# EAGLE design combo-02 (EAGLE 7.7.0)
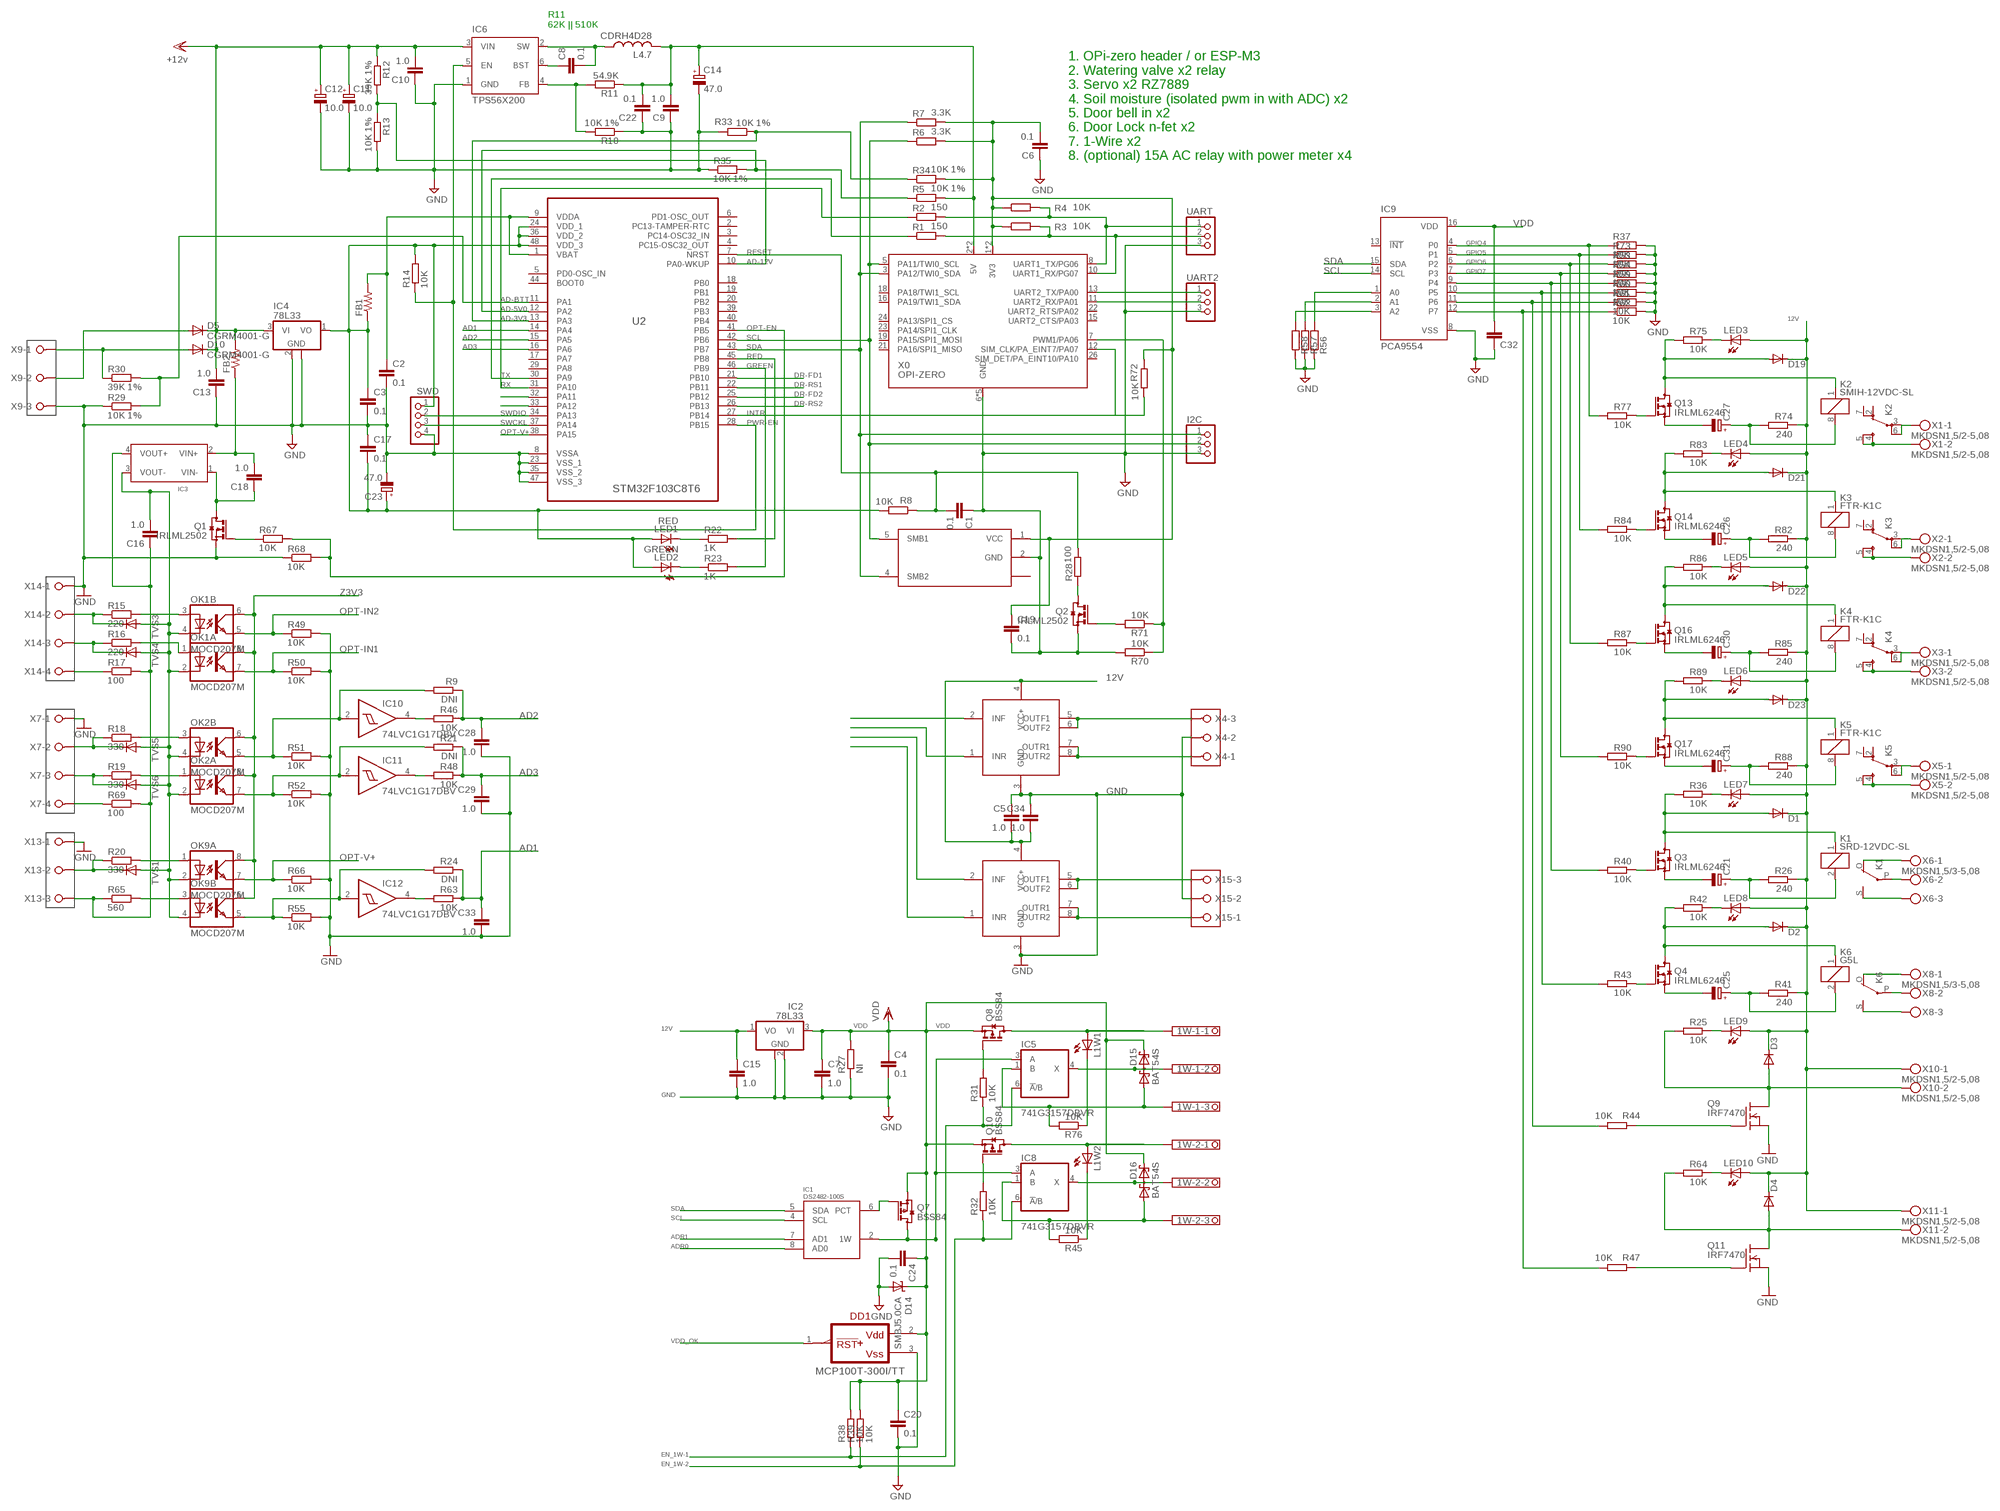
[diagram p0: schematic, sheet 1]

## Parts
1W-1  1751251  [1751251]
1W-2  1751251  [1751251]
C1  0.1  C-EUC0603  [C0603]
C2  0.1  C-EUC0603  [C0603]
C3  0.1  C-EUC0603  [C0603]
C4  0.1  C-EUC0603  [C0603]
C5  1.0  C-EUC0805  [C0805]
C6  0.1  C-EUC0805  [C0805]
C7  1.0  C-EUC0805  [C0805]
C8  0.1  C-EUC0805  [C0805]
C9  1.0  C-EUC0805  [C0805]
C10  1.0  C-EUC1206  [C1206]
C11  10.0  CPOL-EUC/6032-28R  [C/6032-28R]
C12  10.0  CPOL-EUC/6032-28R  [C/6032-28R]
C13  1.0  C-EUC1206  [C1206]
C14  47.0  CPOL-EUB/3528-21R  [B/3528-21R]
C15  1.0  C-EUC0805  [C0805]
C16  1.0  C-EUC1206  [C1206]
C17  0.1  C-EUC0603  [C0603]
C18  1.0  C-EUC1206  [C1206]
C19  0.1  C-EUC0603  [C0603]
C20  0.1  C-EUC0603  [C0603]
C21  CPOL-EUE3.5-8  [E3,5-8]
C22  0.1  C-EUC0805  [C0805]
C23  47.0  CPOL-EUB/3528-21R  [B/3528-21R]
C24  0.1  C-EUC0603  [C0603]
C25  CPOL-EUE3.5-8  [E3,5-8]
C26  CPOL-EUE3.5-8  [E3,5-8]
C27  CPOL-EUE3.5-8  [E3,5-8]
C28  1.0  C-EUC0805  [C0805]
C29  1.0  C-EUC0805  [C0805]
C30  CPOL-EUE3.5-8  [E3,5-8]
C31  CPOL-EUE3.5-8  [E3,5-8]
C32  C-EUC0805  [C0805]
C33  1.0  C-EUC0805  [C0805]
C34  1.0  C-EUC0805  [C0805]
D1  DIODE-SOD123  [SOD123]
D2  DIODE-SOD123  [SOD123]
D3  DIODE-SOD123  [SOD123]
D4  DIODE-SOD123  [SOD123]
D5  CGRM4001-G  [SOD-123_MINI-SMA]
D10  CGRM4001-G  [SOD-123_MINI-SMA]
D14  SMBJ5.0CA  SUPPRESSOR-SMBJ  [SMBJ]
D15  BAT54S  [SOT23]
D16  BAT54S  [SOT23]
D19  DIODE-SOD123  [SOD123]
D21  DIODE-SOD123  [SOD123]
D22  DIODE-SOD123  [SOD123]
D23  DIODE-SOD123  [SOD123]
DD1  MCP100T-300I/TT  [SOT23]
FB1  R-US_R0805  [R0805]
FB2  R-US_R1206  [R1206]
I2C  PINHD-1X3  [1X03]
IC1  DS2482-100S  [SO08]
IC2  78L33  78L05F  [SOT89]
IC3  DC-DC-CONV-4PIN-ISOLATINGMURATA-NME-05-12-SERIES  [DC-DC-MURATA-NME-05-12-SERIES]
IC4  78L33  78L05F  [SOT89]
IC5  741G3157DBVR  [DBV_R-PDSO-G6]
IC6  TPS56X200  [TSOT23-6_DDC]
IC7  LTC1694  [SOT23-5]
IC8  741G3157DBVR  [DBV_R-PDSO-G6]
IC9  PCA9554  PCF8574T  [SO16W]
IC10  74LVC1G17DBV  [SOT23-5]
IC11  74LVC1G17DBV  [SOT23-5]
IC12  74LVC1G17DBV  [SOT23-5]
K1  SRD-12VDC-SL  G5L  [G5LE]
K2  SMIH-12VDC-SL  FTR-K1C  [FTR-K1C]
K3  FTR-K1C  [FTR-K1C]
K4  FTR-K1C  [FTR-K1C]
K5  FTR-K1C  [FTR-K1C]
K6  G5L  [G5LE]
L1W1  LEDSMT1206  [1206]
L1W2  LEDSMT1206  [1206]
L4.7  CDRH4D28  [CDRH4D28]
LED1  RED  LEDCHIPLED_1206  [CHIPLED_1206]
LED2  GREEN  LEDCHIPLED_1206  [CHIPLED_1206]
LED3  LEDSMT1206  [1206]
LED4  LEDSMT1206  [1206]
LED5  LEDSMT1206  [1206]
LED6  LEDSMT1206  [1206]
LED7  LEDSMT1206  [1206]
LED8  LEDSMT1206  [1206]
LED9  LEDSMT1206  [1206]
LED10  LEDSMT1206  [1206]
OK1  MOCD207M  [SOIC08-FAIRCHILD]
OK2  MOCD207M  [SOIC08-FAIRCHILD]
OK9  MOCD207M  [SOIC08-FAIRCHILD]
Q1  IRLML2502  [SOT23]
Q2  IRLML2502  [SOT23]
Q3  IRLML6246  BSS123  [SOT23]
Q4  IRLML6246  BSS123  [SOT23]
Q7  BSS84  [SOT23]
Q8  BSS84  [SOT23]
Q9  IRF7470  FDS5680  [SO-8]
Q10  BSS84  [SOT23]
Q11  IRF7470  FDS5680  [SO-8]
Q13  IRLML6246  BSS123  [SOT23]
Q14  IRLML6246  BSS123  [SOT23]
Q16  IRLML6246  BSS123  [SOT23]
Q17  IRLML6246  BSS123  [SOT23]
R1  150  R-EU_R0603  [R0603]
R2  150  R-EU_R0603  [R0603]
R3  10K  R-EU_R0603  [R0603]
R4  10K  R-EU_R0603  [R0603]
R5  10K 1%  R-EU_R0603  [R0603]
R6  3.3K  R-EU_R0603  [R0603]
R7  3.3K  R-EU_R0603  [R0603]
R8  10K  R-EU_R0603  [R0603]
R9  DNI  R-EU_R0603  [R0603]
R10  10K 1%  R-EU_R0603  [R0603]
R11  54.9K  R-EU_R0603  [R0603]
R12  39K 1%  R-EU_R0603  [R0603]
R13  10K 1%  R-EU_R0603  [R0603]
R14  10K  R-EU_R0603  [R0603]
R15  220  R-EU_R0603  [R0603]
R16  220  R-EU_R0603  [R0603]
R17  100  R-EU_R0603  [R0603]
R18  330  R-EU_R0603  [R0603]
R19  330  R-EU_R0603  [R0603]
R20  330  R-EU_R0603  [R0603]
R21  DNI  R-EU_R0603  [R0603]
R22  1K  R-EU_R0603  [R0603]
R23  1K  R-EU_R0603  [R0603]
R24  DNI  R-EU_R0603  [R0603]
R25  10K  R-EU_R0603  [R0603]
R26  240  R-EU_R1206  [R1206]
R27  NI  R-EU_R0603  [R0603]
R28  100  R-EU_R0603  [R0603]
R29  10K 1%  R-EU_R0603  [R0603]
R30  39K 1%  R-EU_R0603  [R0603]
R31  10K  R-EU_R0603  [R0603]
R32  10K  R-EU_R0603  [R0603]
R33  10K 1%  R-EU_R0603  [R0603]
R34  10K 1%  R-EU_R0603  [R0603]
R35  10K 1%  R-EU_R0603  [R0603]
R36  10K  R-EU_R0603  [R0603]
R37  10K  R-EU_R0603  [R0603]
R38  10K  R-EU_R0603  [R0603]
R39  10K  R-EU_R0603  [R0603]
R40  10K  R-EU_R0603  [R0603]
R41  240  R-EU_R1206  [R1206]
R42  10K  R-EU_R0603  [R0603]
R43  10K  R-EU_R0603  [R0603]
R44  10K  R-EU_R0603  [R0603]
R45  10K  R-EU_R0603  [R0603]
R46  10K  R-EU_R0603  [R0603]
R47  10K  R-EU_R0603  [R0603]
R48  10K  R-EU_R0603  [R0603]
R49  10K  R-EU_R0603  [R0603]
R50  10K  R-EU_R0603  [R0603]
R51  10K  R-EU_R0603  [R0603]
R52  10K  R-EU_R0603  [R0603]
R53  10K  R-EU_R0603  [R0603]
R54  10K  R-EU_R0603  [R0603]
R55  10K  R-EU_R0603  [R0603]
R56  R-EU_R0603  [R0603]
R57  R-EU_R0603  [R0603]
R58  R-EU_R0603  [R0603]
R59  10K  R-EU_R0603  [R0603]
R60  10K  R-EU_R0603  [R0603]
R61  10K  R-EU_R0603  [R0603]
R62  10K  R-EU_R0603  [R0603]
R63  10K  R-EU_R0603  [R0603]
R64  10K  R-EU_R0603  [R0603]
R65  560  R-EU_R0603  [R0603]
R66  10K  R-EU_R0603  [R0603]
R67  10K  R-EU_R0603  [R0603]
R68  10K  R-EU_R0603  [R0603]
R69  100  R-EU_R0603  [R0603]
R70  10K  R-EU_R0603  [R0603]
R71  10K  R-EU_R0603  [R0603]
R72  10K  R-EU_R0603  [R0603]
R73  10K  R-EU_R0603  [R0603]
R74  240  R-EU_R1206  [R1206]
R75  10K  R-EU_R0603  [R0603]
R76  10K  R-EU_R0603  [R0603]
R77  10K  R-EU_R0603  [R0603]
R82  240  R-EU_R1206  [R1206]
R83  10K  R-EU_R0603  [R0603]
R84  10K  R-EU_R0603  [R0603]
R85  240  R-EU_R1206  [R1206]
R86  10K  R-EU_R0603  [R0603]
R87  10K  R-EU_R0603  [R0603]
R88  240  R-EU_R1206  [R1206]
R89  10K  R-EU_R0603  [R0603]
R90  10K  R-EU_R0603  [R0603]
SWD  PINHD-1X4  [1X04]
TVS1  DIODE-SOD323-W  [SOD323-W]
TVS3  DIODE-SOD323-W  [SOD323-W]
TVS4  DIODE-SOD323-W  [SOD323-W]
TVS5  DIODE-SOD323-W  [SOD323-W]
TVS6  DIODE-SOD323-W  [SOD323-W]
U2  STM32F103C8T6  STM32F100CBT6B  [QFP50P900X900X160-48N]
U$10  RZ7889  [SO8]
U$11  RZ7889  [SO8]
UART  PINHD-1X3  [1X03]
UART2  PINHD-1X3  [1X03]
X0  OPI-ZERO  [OPI0]
X1  MKDSN1,5/2-5,08  [MKDSN1,5/2-5,08]
X2  MKDSN1,5/2-5,08  [MKDSN1,5/2-5,08]
X3  MKDSN1,5/2-5,08  [MKDSN1,5/2-5,08]
X4  W237-03P  [W237-133]
X5  MKDSN1,5/2-5,08  [MKDSN1,5/2-5,08]
X6  MKDSN1,5/3-5,08  [MKDSN1,5/3-5,08]
X7  W237-04P  [W237-4P]
X8  MKDSN1,5/3-5,08  [MKDSN1,5/3-5,08]
X9  W237-03P  [W237-133]
X10  MKDSN1,5/2-5,08  [MKDSN1,5/2-5,08]
X11  MKDSN1,5/2-5,08  [MKDSN1,5/2-5,08]
X13  W237-03P  [W237-133]
X14  W237-04P  [W237-4P]
X15  W237-03P  [W237-133]

## Nets
1W: IC1.2(1W) IC5.3(A) IC8.3(A) Q7.3(D)
1W1-VDD: 1W-1.1 L1W1.A Q8.3(D)
1W2-VDD: 1W-2.1 L1W2.A Q10.3(D)
12V [POWER]: C5.2 C10.2 C11.+ C12.+ C13.2 C15.1 C34.2 D1.C D2.C D3.C D4.C D5.C D10.C D19.C D21.C D22.C D23.C FB2.2 IC2.1(VO) IC4.3(VI) IC6.3(VIN) LED3.A LED4.A LED5.A LED6.A LED7.A LED8.A LED9.A LED10.A R12.1 R26.1 R41.1 R74.1 R82.1 R85.1 R88.1 U$10.4(VCC+) U$11.4(VCC+) X10.1 X11.1 ; supply symbol labelled +12v
+3V3 [POWER]: C3.1 C17.2 C23.+ FB1.1 IC4.1(VO) LED1.A LED2.A R8.2 R14.2 SWD.1 U2.24(VDD_1) U2.36(VDD_2) U2.48(VDD_3)
AD1: C33.1 R24.1 R63.1 U2.14(PA4)
AD2: C28.1 R9.1 R46.1 U2.15(PA5)
AD3: C29.1 R21.1 R48.1 U2.16(PA6)
AD-3V3: R33.1 R34.1 U2.13(PA3)
AD-5V0: R5.1 R35.2 U2.12(PA2)
AD-12V: R12.2 R13.1 U2.10(PA0-WKUP)
AD-BTT: R29.2 R30.2 U2.11(PA1)
ADR0: IC1.8(AD0)
ADR1: IC1.7(AD1)
ADR2: IC9.3(A2) R58.2
ADR3: IC9.2(A1) R57.2
ADR4: IC9.1(A0) R56.2
BAT+ [POWER]: D10.A R30.1 X9.1
DR-FD1: U2.21(PB10)
DR-FD2: U2.25(PB12)
DR-RS1: U2.22(PB11)
DR-RS2: U2.26(PB13)
EN_1W-1: IC5.6(!A!/B) R31.1 R38.1
EN_1W-2: IC8.6(!A!/B) R32.1 R39.1
FET: D3.A Q9.5(D) Q9.6(D) Q9.7(D) Q9.8(D) R25.2 X10.2
FET1: D4.A Q11.5(D) Q11.6(D) Q11.7(D) Q11.8(D) R64.2 X11.2
GND [POWER]: 1W-1.3 1W-2.3 C1.1 C2.2 C3.2 C4.2 C5.1 C6.1 C7.2 C9.1 C10.1 C11.- C12.- C13.1 C14.- C15.2 C17.1 C19.2 C20.2 C21.- C22.1 C23.- C24.2 C25.- C26.- C27.- C28.2 C29.2 C30.- C31.- C32.1 C33.2 C34.1 D14.A D15.1(A1) D16.1(A1) DD1.3(VSS) I2C.3 IC2.2(GND) IC2.2@1(GND) IC4.2(GND) IC4.2@1(GND) IC5.1(B) IC6.1(GND) IC7.2(GND) IC8.1(B) IC9.8(VSS) Q1.2(S) Q2.2(S) Q3.2(S) Q4.2(S) Q9.1(S) Q9.2(S) Q9.3(S) Q11.1(S) Q11.2(S) Q11.3(S) Q13.2(S) Q14.2(S) Q16.2(S) Q17.2(S) R10.1 R13.2 R27.1 R29.1 R33.2 R35.1 R37.2 R45.2 R49.2 R50.2 R51.2 R52.2 R53.2 R54.2 R55.2 R56.1 R57.1 R58.1 R59.2 R60.2 R61.2 R62.2 R66.2 R68.1 R70.2 R73.2 R76.2 SWD.4 U2.8(VSSA) U2.23(VSS_1) U2.35(VSS_2) U2.47(VSS_3) U$10.3(GND) U$11.3(GND) UART2.3 UART.3 X0.6(GND) X0.9(GND) X0.14(GND) X0.20(GND) X0.25(GND) X4.2 X7.1 X9.3 X13.1 X14.1 X15.2
GPIO1: IC9.9(P4) R40.2 R59.1
GPIO2: IC9.10(P5) R43.2 R60.1
GPIO4: IC9.4(P0) R37.1 R77.2
GPIO5: IC9.5(P1) R73.1 R84.2
GPIO6: IC9.6(P2) R53.1 R87.2
GPIO7: IC9.7(P3) R54.1 R90.2
GREEN: R23.2 U2.46(PB9)
IN12V [POWER]: D5.A X9.2
INTR: R72.2 U2.27(PB14) X0.12(SIM_CLK/PA_EINT7/PA07)
IO13: IC9.11(P6) R44.2 R61.1
N$1: C16.1 IC3.4(VOUT+) R17.2 R65.1 R69.2 X13.3
N$2: K3.4(-1:SA) K3.5(-1:SB) X2.2
N$3 [POWER]: C8.2 IC6.2(SW) L4.7.P$1
N$4: Q2.3(D) R28.1
N$5: Q2.1(G) R71.2
N$7: OK9.1(A:A) R20.2
N$8: OK9.3(B:A) R65.2
N$9: IC10.2(I) OK2.5(B:EMIT) R9.2 R51.1
N$10: Q9.4(G) R44.1
N$11: IC1.6(PCT) Q7.1(G)
N$13: Q14.1(G) R84.1
N$14: OK1.3(B:A) R15.2
N$15: D1.A K1.1 Q3.3(D) R36.2
N$16: C21.+ K1.2 R26.2
N$17: C8.1 IC6.6(BST)
N$18: LED7.C R36.1
N$19: Q3.1(G) R40.1
N$20: D2.A K6.1 Q4.3(D) R42.2
N$21: C25.+ K6.2 R41.2
N$22: IC6.4(FB) R10.2 R11.2
N$23: LED8.C R42.1
N$24: Q4.1(G) R43.1
N$25: R20.1 TVS1.C X13.2
N$26: R15.1 TVS3.C X14.2
N$27: 1W-1.2 D15.3(C1A2) IC5.4(X)
N$28: R16.1 TVS4.C X14.3
N$29: C16.2 IC3.3(VOUT-) OK1.2(A:C) OK1.4(B:C) OK2.2(A:C) OK2.4(B:C) OK9.2(A:C) OK9.4(B:C) TVS1.A TVS3.A TVS4.A TVS5.A TVS6.A
N$30: R17.1 X14.4
N$31: U$10.2(INF)
N$32: R18.1 TVS5.C X7.2
N$33: R19.1 TVS6.C X7.3
N$34: U$10.1(INR)
N$35: OK2.3(B:A) R18.2
N$36: IC12.2(I) OK9.5(B:EMIT) R24.2 R55.1
N$37: Q8.1(G) R31.2
N$38: U$11.2(INF)
N$39: IC9.12(P7) R47.2 R62.1
N$40: K3.3(-1:PA) K3.6(-1:PB) X2.1
N$41: 1W-2.2 D16.3(C1A2) IC8.4(X)
N$42: K4.3(-1:PA) K4.6(-1:PB) X3.1
N$43: K4.4(-1:SA) K4.5(-1:SB) X3.2
N$44: K5.3(-1:PA) K5.6(-1:PB) X5.1
N$45: Q10.1(G) R32.2
N$46: K5.4(-1:SA) K5.5(-1:SB) X5.2
N$47: K1.P(2:P) X6.2
N$48: K1.O(2:O) X6.1
N$49: K1.S(2:S) X6.3
N$50: K6.O(2:O) X8.1
N$51: K6.P(2:P) X8.2
N$52: K6.S(2:S) X8.3
N$53: IC10.4(O) R46.2
N$54: IC11.4(O) R48.2
N$55: D19.A K2.1 Q13.3(D) R75.2
N$56: IC12.4(O) R63.2
N$57: U$11.1(INR)
N$58: U$10.5(OUTF1) U$10.6(OUTF2) X4.3
N$59: U$10.7(OUTR1) U$10.8(OUTR2) X4.1
N$60: C27.+ K2.8 R74.2
N$61: U$11.5(OUTF1) U$11.6(OUTF2) X15.3
N$62: LED3.C R75.1
N$63: U$11.7(OUTR1) U$11.8(OUTR2) X15.1
N$65: OK1.1(A:A) R16.2
N$66: OK2.1(A:A) R19.2
N$69: Q11.4(G) R47.1
N$70: LED10.C R64.1
N$71: LED9.C R25.1
N$74: R69.1 X7.4
N$75: LED1.C R22.1
N$95: Q1.1(G) R67.1
N$98: C18.1 IC3.1(VIN-) Q1.3(D)
N$99 [POWER]: C18.2 FB2.1 IC3.2(VIN+)
N$111: D21.A K3.1 Q14.3(D) R83.2
N$112: Q13.1(G) R77.1
N$115: L1W2.C R45.1
N$116: L1W1.C R76.1
N$117: C26.+ K3.8 R82.2
N$118: LED4.C R83.1
N$119: LED2.C R23.1
N$120: D22.A K4.1 Q16.3(D) R86.2
N$121: C30.+ K4.8 R85.2
N$122: LED5.C R86.1
N$123: Q16.1(G) R87.1
N$124: D23.A K5.1 Q17.3(D) R89.2
N$125: C31.+ K5.8 R88.2
N$126: LED6.C R89.1
N$127: Q17.1(G) R90.1
N$128: K2.3(-1:PA) K2.6(-1:PB) X1.1
N$129: K2.4(-1:SA) K2.5(-1:SB) X1.2
OPT-EN: R67.2 R68.2 U2.41(PB5)
OPT-IN1: OK1.7(A:EMIT) R50.1 U2.32(PA11)
OPT-IN2: OK1.5(B:EMIT) R49.1 U2.33(PA12)
OPT-V+: OK9.7(A:EMIT) R66.1 U2.38(PA15)
PA06: R70.1 R71.1 X0.7(PWM1/PA06)
PWR-EN: IC6.5(EN) R14.1 U2.28(PB15)
RED: R22.2 U2.45(PB8)
RESET: C1.2 R8.1 R28.2 U2.7(NRST)
RX: R2.1 U2.31(PA10)
SCL: I2C.2 IC1.4(SCL) IC7.5(SMB1) IC9.14(SCL) R6.1 U2.42(PB6) X0.5(PA11/TWI0_SCL)
SDA: I2C.1 IC1.5(SDA) IC7.4(SMB2) IC9.15(SDA) R7.1 U2.43(PB7) X0.3(PA12/TWI0_SDA)
SWCKL: SWD.3 U2.37(PA14)
SWDIO: SWD.2 U2.34(PA13)
TX: R1.1 U2.30(PA9)
VDD: C4.1 C7.1 C20.1 C24.1 C32.2 D14.C D15.2(C2) D16.2(C2) DD1.2(VDD) IC2.3(VI) IC9.16(VDD) Q7.2(S) Q8.2(S) Q10.2(S) R27.2 R38.2 R39.2
VDD_OK: DD1.1(!RST)
VDDA: C2.1 FB1.2 U2.1(VBAT) U2.9(VDDA)
X7.2: IC11.2(I) OK2.7(A:EMIT) R21.2 R52.1
Z2RX: UART2.2 X0.11(UART2_RX/PA01)
Z2TX: UART2.1 X0.13(UART2_TX/PA00)
Z3V3 [POWER]: C6.2 C19.1 IC7.1(VCC) OK1.6(B:COL) OK1.8(A:COL) OK2.6(B:COL) OK2.8(A:COL) OK9.6(B:COL) OK9.8(A:COL) R3.1 R4.1 R6.2 R7.2 R34.2 R72.1 X0.1(3V3) X0.17(3V3)
Z5V [POWER]: C9.2 C14.+ C22.2 L4.7.P$2 R5.2 R11.1 X0.2(5V) X0.4(5V)
ZRX: R1.2 R3.2 UART.2 X0.10(UART1_RX/PG07)
ZTX: R2.2 R4.2 UART.1 X0.8(UART1_TX/PG06)
Unconnected: IC7.3(NC) IC9.13(!INT) K2.2(-1:OA) K2.7(-1:OB) K3.2(-1:OA) K3.7(-1:OB) K4.2(-1:OA) K4.7(-1:OB) K5.2(-1:OA) K5.7(-1:OB) U2.2(PC13-TAMPER-RTC) U2.3(PC14-OSC32_IN) U2.4(PC15-OSC32_OUT) U2.5(PD0-OSC_IN) U2.6(PD1-OSC_OUT) U2.17(PA7) U2.18(PB0) U2.19(PB1) U2.20(PB2) U2.29(PA8) U2.39(PB3) U2.40(PB4) U2.44(BOOT0) X0.15(UART2_CTS/PA03) X0.16(PA19/TWI1_SDA) X0.18(PA18/TWI1_SCL) X0.19(PA15/SPI1_MOSI) X0.21(PA16/SPI1_MISO) X0.22(UART2_RTS/PA02) X0.23(PA14/SPI1_CLK) X0.24(PA13/SPI1_CS) X0.26(SIM_DET/PA_EINT10/PA10)

## Notes on the sheet
- R11
  62K || 510K
- 1. OPi-zero header / or ESP-M3 
  2. Watering valve x2 relay
  3. Servo x2 RZ7889
  4. Soil moisture (isolated pwm in with ADC) x2
  5. Door bell in x2
  6. Door Lock n-fet x2
  7. 1-Wire x2
  8. (optional) 15A AC relay with power meter x4

## Power pins joined to a net without a drawn wire
12V: IC1.1(VDD)
+3V3: IC5.5(VCC) IC8.5(VCC)
GND: IC1.3(GND) IC5.2(GND) IC8.2(GND) IC10.3(GND) IC11.3(GND) IC12.3(GND)
VCC: IC10.5(VCC) IC11.5(VCC) IC12.5(VCC)

## Library data of the parts
1W-1 1W-2 = con-phoenix-350:1751251: MKDS 1/ 3-3,5 Printklemme Nennstrom: 10 A Bemessungsspannung: 160 V Raster: 3,5 mm Polzahl: 3 Montageart: Löten Anschlussart: Schraubanschluss Anschlussrichtung vom Leiter zur Platine: 0° Source: http://eshop.phoenixcontact.com .. 1751251.pdf; OC_FARNELL: unknown; OC_NEWARK: unknown
C1-C10 C13 C15-C20 C22 C24 C28 C29 C32-C34 = rcl:C-EU: CAPACITOR, European symbol
C11 C12 C14 C21 C23 C25-C27 C30 C31 = rcl:CPOL-EU: POLARIZED CAPACITOR, European symbol
D1-D4 D19 D21-D23 TVS1 TVS3-TVS6 = diode:DIODE-: DIODE
D5 D10 = diode:CGRM400*-G: Molded plasitc,JEDEC SOD-123/Mini SMA Source: Comchip CGRM4001-G.pdf
D14 = diode:SUPPRESSOR-: Suppressor diode
D15 D16 = diode:BAT54S: Schottky Diodes Pin connection corrected 2011-05-04 Source: Fairchild .. BAT54.pdf
DD1 = ic-microchip:MCP100; MOUSER: 579-MCP100T-300I/TT
FB1 FB2 = rcl:R-US_: RESISTOR, American symbol
I2C UART UART2 = pinhead:PINHD-1X3: PIN HEADER
IC1 = 1wire:DS2482-100: I2C to 1-Wire Host Adapter/Line Driver This device is a onewire host and I2C interface in one chip. It provides the complete DC/AC requirements for onewire communication, including overdrive speed mode, but, unlike the DS2480B chip, no 12V EPROM programming. Notes: For overdrive speed and 5V EEPROM programming, an external active pullup circuit must be connected to the 1W, VDD and PCT pin. See the datasheet for details. The lower two I2C adress bits of the chip can be selected by external pins, so up to 4 chips may be connected to the same I2C bus. Author: Orginal device and description from Giovanni Varasano <giovanni.varasano@fastwebnet.it> Improved by Jan Kandziora <jjj@gmx.de>
IC2 IC4 = linear:78L*: POSITOIV-VOLTAGE REGULATORS Output up to 100 mA Source: Datasheet <http://focus.ti.com/lit/ds/symlink/ua78l05.pdf>
IC3 = SteveMarple:DC-DC-CONV-4PIN-ISOLATING
IC5 IC8 = 74xx-little-de:74*1G3157: Single-Pole, Double-Throw Analog Switch Source: http://focus.ti.com/lit/ds/symlink/sn74lvc1g3157.pdf
IC6 = custom:TPS56X200
IC7 = components:LTC1694: Dual SMBus active pull-up
IC9 = micro-philips:PCF8574: I2C-Bus Remote 8-bit I/O expander http://www.semiconductors.philips.com/acrobat_download/datasheets/PCF8574_4.pdf; MPN: PCF8574T/3,512; OC_FARNELL: 1201255; OC_NEWARK: 70R6870
IC10-IC12 = 74xx-little-us:74*1G17: Single Schmitt-Trigger Buffer
K1 K6 = relay:G5L: RELAY 1 x switch, 10 A/120 V AC, 8 A/30 V ADC, Omron; OC_FARNELL: unknown; OC_NEWARK: unknown
K2-K5 = relay:FTR-K1C: NETZRELAIS FTR-K1CK024W1XUM 16A/250VAC 1 Umschaltkontakt Distributor: Conrad Electronic Bestell Nr.: 504389-13 - 24V Source: http://www.produktinfo.conrad.com/datenblaetter/500000-524999/504384-da-01-de-NETZRELAIS_FTR_K1CK012W1XUM_16A_250VAC.pdf; OC_FARNELL: unknown; OC_NEWARK: unknown
L1W1 L1W2 LED1-LED10 = led:LED: LED OSRAM: - CHIPLED LG R971, LG N971, LY N971, LG Q971, LY Q971, LO R971, LY R971 LH N974, LH R974 LS Q976, LO Q976, LY Q976 LO Q996 - Hyper CHIPLED LW Q18S LB Q993, LB Q99A, LB R99A - SideLED LS A670, LO A670, LY A670, LG A670, LP A670 LB A673, LV A673, LT A673, LW A673 LH A674 LY A675 LS A676, LA A676, LO A676, LY A676, LW A676 LS A679, LY A679, LG A679 - Hyper Micro SIDELED® LS Y876, LA Y876, LO Y876, LY Y876 LT Y87S - SmartLED LW L88C, LW L88S LB L89C, LB L89S, LG L890 LS L89K, LO L89K, LY L89K LS L896, LA L896, LO L896, LY L896 - TOPLED LS T670, LO T670, LY T670, LG T670, LP T670 LSG T670, LSP T670, LSY T670, LOP T670, LYG T670 LG T671, LOG T671, LSG T671 LB T673, LV T673, LT T673, LW T673 LH T674 LS T676, LA T676, LO T676, LY T676, LB T676, LH T676, LSB T676, LW T676 LB T67C, LV T67C, LT T67C, LS T67K, LO T67K, LY T67K, LW E67C LS E67B, LA E67B, LO E67B, LY E67B, LB E67C, LV E67C, LT E67C LW T67C LS T679, LY T679, LG T679 LS T770, LO T770, LY T770, LG T770, LP T770 LB T773, LV T773, LT T773, LW T773 LH T774 LS E675, LA E675, LY E675, LS T675 LS T776, LA T776, LO T776, LY T776, LB T776 LHGB T686 LT T68C, LB T68C - Hyper Mini TOPLED® LB M676 - Mini TOPLED Santana® LG M470 LS M47K, LO M47K, LY M47K Source: http://www.osram.convergy.de LUXEON: - LUMILED® LXK2-PW12-R00, LXK2-PW12-S00, LXK2-PW14-U00, LXK2-PW14-V00 LXK2-PM12-R00, LXK2-PM12-S00, LXK2-PM14-U00 LXK2-PE12-Q00, LXK2-PE12-R00, LXK2-PE12-S00, LXK2-PE14-T00, LXK2-PE14-U00 LXK2-PB12-K00, LXK2-PB12-L00, LXK2-PB12-M00, LXK2-PB14-N00, LXK2-PB14-P00, LXK2-PB14-Q00 LXK2-PR12-L00, LXK2-PR12-M00, LXK2-PR14-Q00, LXK2-PR14-R00 LXK2-PD12-Q00, LXK2-PD12-R00, LXK2-PD12-S00 LXK2-PH12-R00, LXK2-PH12-S00 LXK2-PL12-P00, LXK2-PL12-Q00, LXK2-PL12-R00 Source: www.luxeon.com KINGBRIGHT: KA-3528ASYC Source: www.kingbright.com
L4.7 = custom:CDRH4D28
OK1 OK2 OK9 = optocoupler:MOCD20*M: MOCD207M, MOCD208M Dual Channel Phototransistor Small Outline Surface Mount Optocouplers Source: Data sheet <http://www.fairchildsemi.com/ds/MO%2FMOCD207-M.pdf>; MF: FAIRCHILD SEMICONDUCTOR; MPN: MOCD207-M; OC_FARNELL: 1623297; OC_NEWARK: 67K0803
Q1 Q2 = components:IRLML2502: N-CHANNEL MOS FET
Q3 Q4 Q13 Q14 Q16 Q17 = transistor-small-signal:BSS123: N-CHANNEL MOS FET
Q7 Q8 Q10 = transistor-small-signal:BSS84: P-CHANNEL MOS FET
Q9 Q11 = transistor-fet:FDS5680: 60V N-Channel PowerTrench TM MOSFET FAIRCHILD FDS5680.pdf
R1-R77 R82-R90 = rcl:R-EU_: RESISTOR, European symbol
SWD = pinhead:PINHD-1X4: PIN HEADER
U2 = ST Microelctronics_By_element14_Batch_1:STM32F100CBT6B: ARM-based 32-bit MCU; MPN: STM32F100CBT6B; OC_FARNELL: 1838512; OC_NEWARK: 86R1308; PACKAGE: LQFP-48; SUPPLIER: STMircroelectronics
U$10 U$11 = components:RZ788
X0 = OrangePi0:OPI-ZERO: Orange Pi Zero Footprint. Only 2x13 pin header. -- UNTESTED!
X1-X3 X5 X10 X11 = con-phoenix-508:MKDSN1,5/2-5,08: MKDSN 1,5/ 2-5,08 Printklemme Nennstrom: 13,5 A Nennspannung: 250 V Rastermaß: 5,08 mm Polzahl: 2 Anschlussart: Schraubanschluss Montage: Löten Anschlussrichtung Leiter/Platine: 0 ° Artikelnummer: 1729128 Source: http://eshop.phoenixcontact.com .. 1729128.pdf
X4 X9 X13 X15 = con-wago-508:W237-03P: WAGO SREW CLAMP; OC_FARNELL: unknown; OC_NEWARK: unknown
X6 X8 = con-phoenix-508:MKDSN1,5/3-5,08: MKDSN 1,5/ 3-5,08 Printklemme Nennstrom: 13,5 A Nennspannung: 250 V Rastermaß: 5,08 mm Polzahl: 3 Anschlussart: Schraubanschluss Montage: Löten Anschlussrichtung Leiter/Platine: 0 ° Artikelnummer: 1729131 Source: http://eshop.phoenixcontact.com .. 1729131.pdf
X7 X14 = con-wago-508:W237-04P: WAGO SREW CLAMP; OC_FARNELL: unknown; OC_NEWARK: unknown

## Net classes
0 default: width 0.254 mm, clearance 0.254 mm
1 POWER: width 0.508 mm, clearance 0.254 mm
2 HV: width 1.27 mm, clearance 1.27 mm

## Board
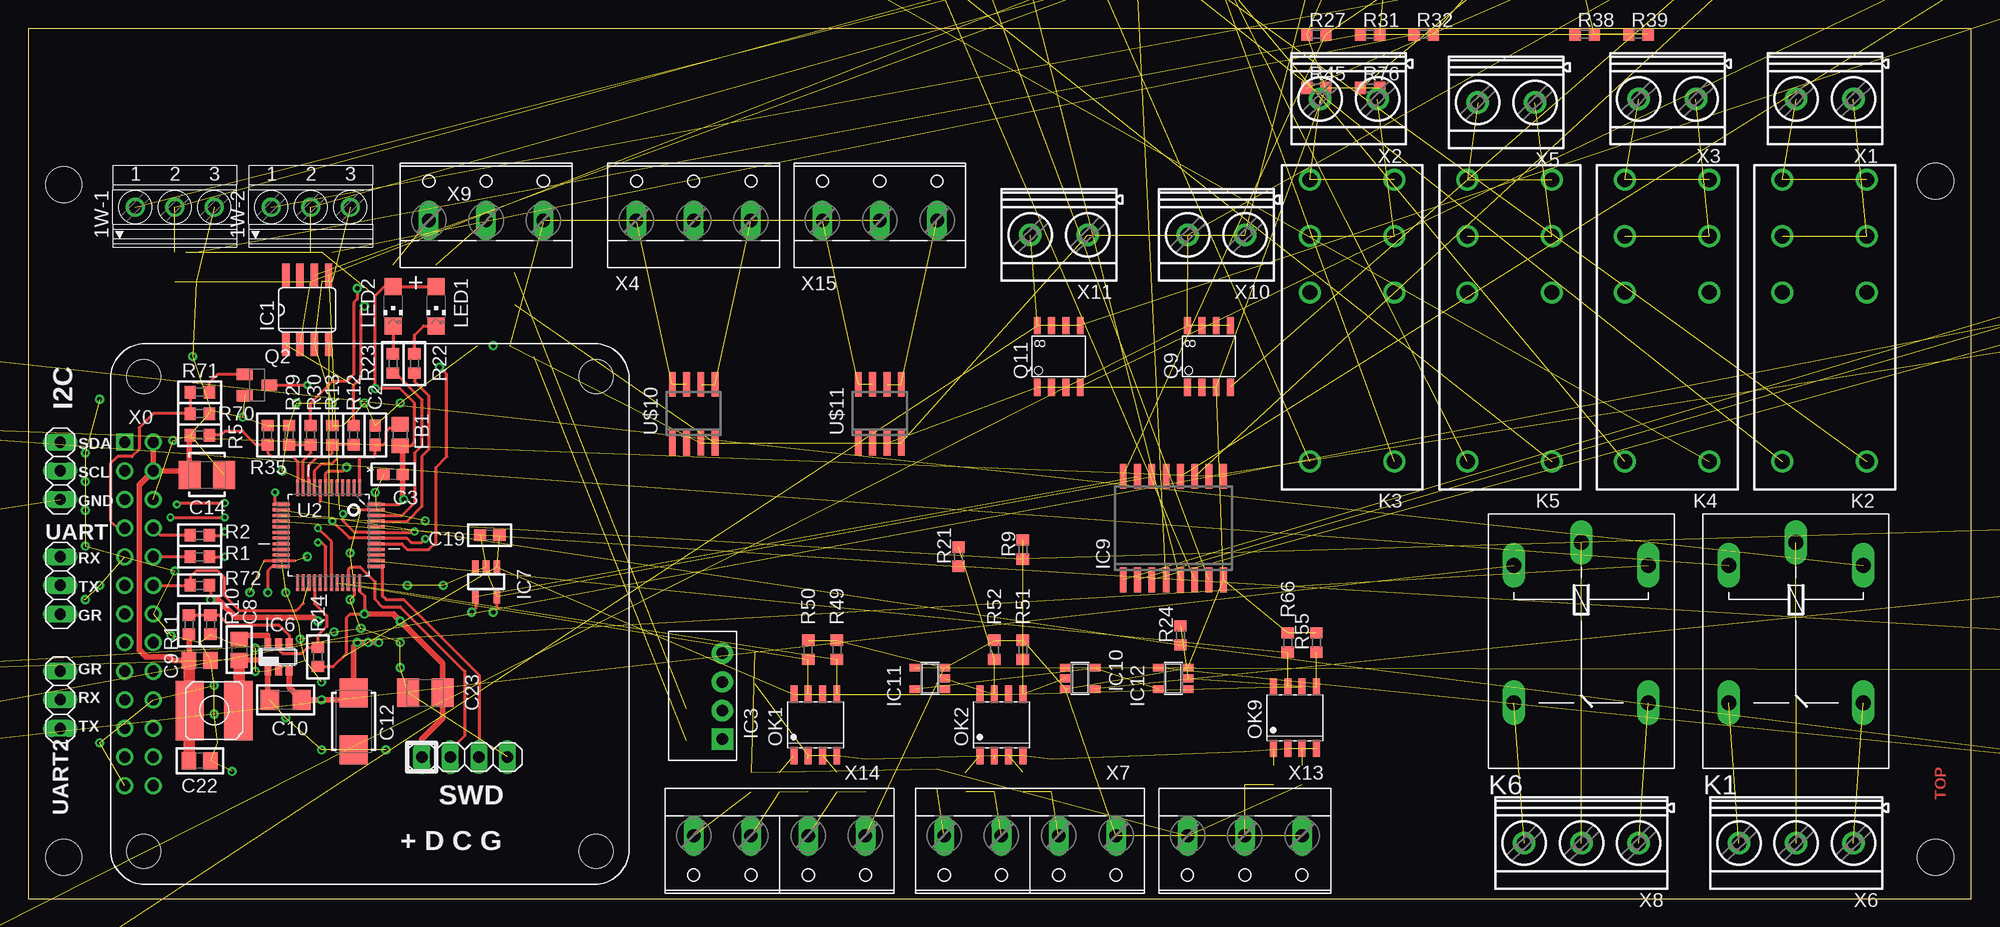
[diagram p1: board, top side]
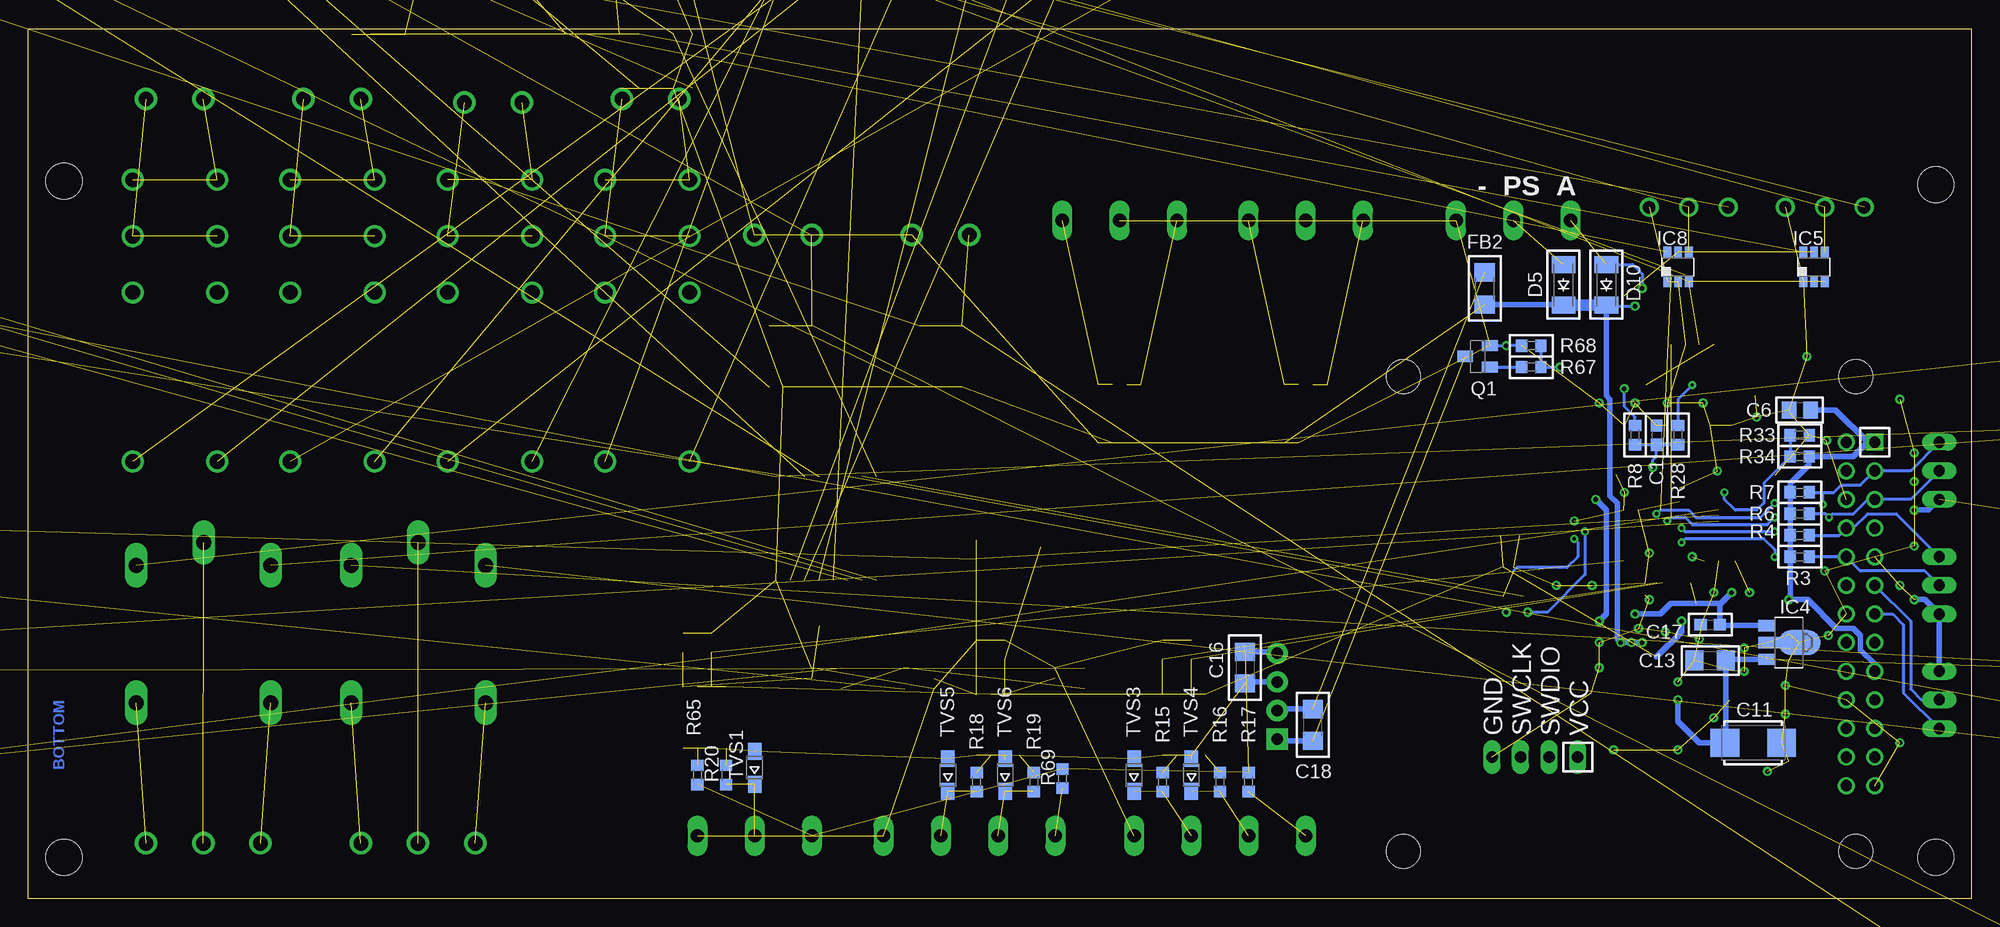
[diagram p2: board, bottom side, seen from below]

Size 172.39 x 77.2 mm. Coordinates in mm from the lower left corner, seen from the top.
Outline: 172.39,0 172.39,77.2 0,77.2 0,0 172.39,0
Copper layers (1*16): Top 0.035mm / dielectric 1.5mm / Bottom 0.035mm
Design rules "default *": minimum track width 10mil, minimum drill 15mil, track to track 4mil, track to pad 4mil, pad to pad 4mil, via to via 8mil, smd to smd 4mil, copper to edge 40mil, drill to drill 10mil, minimum pad ring 10mil, minimum via ring 8mil, stop-mask expansion 4mil, vias tented up to drill 20mil, thermal gap 10mil
Holes 3.2 mm at 3.16,63.37 169.22,63.69 169.22,3.68 3.16,3.68

### Footprints (pad centres in the part's own frame; a part is rotated, then mirrored left to right if it is on the bottom)
1751251 = drill 1.1 pad 1.7: 1 -3.5,-0.1; 2 0,-0.1; 3 3.5,-0.1
C0603 = smd 1.1 x 1: 1 -0.85,0; 2 0.85,0
C0805 = smd 1.3 x 1.5: 1 -0.95,0; 2 0.95,0
C1206 = smd 1.6 x 1.8: 1 -1.4,0; 2 1.4,0
C/6032-28R = smd 2.55 x 2.5: + 2.525,0; - -2.525,0
B/3528-21R = smd 1.95 x 2.5: + 1.525,0; - -1.525,0
E3,5-8 = drill 0.813 pad 1.6: + -1.778,0 | drill 0.813 pad 1.6 octagon: - 1.778,0
SOD123 = smd 1.4 x 1.4: A 1.9,0; C -1.9,0
SOD-123_MINI-SMA = smd 1.5 x 2.1: A 1.8,0; C -1.8,0
SMBJ = smd 1.78 x 2.16: A 2.04,0; C -2.03,0
SOT23 = smd 1 x 1.4: 1 -0.95,-1.1; 2 0.95,-1.1; 3 0,1.1
R0805 = smd 1.3 x 1.5: 1 -0.95,0; 2 0.95,0
R1206 = smd 1.6 x 1.803: 1 -1.422,0; 2 1.422,0
1X03 = drill 1.016 long: 1 -2.54,0; 2 0,0; 3 2.54,0
SO08 = smd 0.66 x 2.032: 1 -1.905,-3.073; 2 -0.635,-3.073; 3 0.635,-3.073; 4 1.905,-3.073; 5 1.905,3.073; 6 0.635,3.073; 7 -0.635,3.073; 8 -1.905,3.073
SOT89 = smd 1 x 1.5: 1 -1.499,-1.981; 3 1.499,-1.981 | smd 1 x 2: 2 0,-1.727 | smd 2.2 x 3.7: 2@1 0,0.94
DC-DC-MURATA-NME-05-12-SERIES = drill 1.016 pad 1.88 square: 1 -3.81,0 | drill 1.016 pad 1.88: 2 -1.27,0; 3 1.27,0; 4 3.81,0
DBV_R-PDSO-G6 = smd 0.69 x 0.99: 1 -0.95,-1.29; 2 0,-1.29; 3 0.95,-1.29; 4 0.95,1.3; 5 0,1.3; 6 -0.95,1.3
TSOT23-6_DDC = smd 0.6 x 0.8: 1 -0.95,-1.25; 2 0,-1.25; 3 0.95,-1.25; 4 0.95,1.25; 5 0,1.25; 6 -0.95,1.25
SOT23-5 = smd 0.6 x 1.2: 1 -0.95,-1.306; 2 0,-1.306; 3 0.95,-1.306; 4 0.95,1.306; 5 -0.95,1.306
SO16W = smd 0.6 x 2.2: 1 -4.445,-4.6; 2 -3.175,-4.6; 3 -1.905,-4.6; 4 -0.635,-4.6; 5 0.635,-4.6; 6 1.905,-4.6; 7 3.175,-4.6; 8 4.445,-4.6; 9 4.445,4.6; 10 3.175,4.6; 11 1.905,4.6; 12 0.635,4.6; 13 -0.635,4.6; 14 -1.905,4.6; 15 -3.175,4.6; 16 -4.445,4.6
SOT23-5' = smd 0.69 x 0.99: 1 -0.95,-1.29; 2 0,-1.29; 3 0.95,-1.29; 4 0.95,1.3; 5 -0.95,1.3
G5LE = drill 1.321 long: 1 -7.493,-5.969; 2 -7.493,5.969; O 4.699,5.969; P -9.525,0; S 4.699,-5.969
FTR-K1C = drill 1.3 pad 1.93: 1 -12.5,-3.75; 2 2.5,-3.75; 3 7.5,-3.75; 4 12.5,-3.75; 5 12.5,3.75; 6 7.5,3.75; 7 2.5,3.75; 8 -12.5,3.75
1206 = smd 1.6 x 1.803: A -1.422,0; C 1.422,0
CDRH4D28 = smd 2.5 x 5.3: P$1 -2.159,0; P$2 2.159,0
CHIPLED_1206 = smd 1.5 x 1.5: A 0,-1.75; C 0,1.75
SOIC08-FAIRCHILD = smd 0.61 x 1.52: 1 -1.905,-2.723; 2 -0.635,-2.723; 3 0.635,-2.723; 4 1.905,-2.723; 5 1.905,2.723; 6 0.635,2.723; 7 -0.635,2.723; 8 -1.905,2.723
SO-8 = smd 1.524 x 0.61: 1 -2.743,1.905; 2 -2.743,0.635; 3 -2.743,-0.635; 4 -2.743,-1.905; 5 2.743,-1.905; 6 2.743,-0.635; 7 2.743,0.635; 8 2.743,1.905
R0603 = smd 1 x 1.1: 1 -0.85,0; 2 0.85,0
1X04 = drill 1.016 long: 1 -3.81,0; 2 -1.27,0; 3 1.27,0; 4 3.81,0
SOD323-W = smd 1.5 x 1.2: A 1.45,0; C -1.45,0
QFP50P900X900X160-48N = smd 1.473 x 0.279: 1 -4.216,2.743; 2 -4.216,2.261; 3 -4.216,1.753; 4 -4.216,1.245; 5 -4.216,0.762; 6 -4.216,0.254; 7 -4.216,-0.254; 8 -4.216,-0.762; 9 -4.216,-1.245; 10 -4.216,-1.753; 11 -4.216,-2.261; 12 -4.216,-2.743; 25 4.216,-2.743; 26 4.216,-2.261; 27 4.216,-1.753; 28 4.216,-1.245; 29 4.216,-0.762; 30 4.216,-0.254; 31 4.216,0.254; 32 4.216,0.762; 33 4.216,1.245; 34 4.216,1.753; 35 4.216,2.261; 36 4.216,2.743 | smd 0.279 x 1.473: 13 -2.743,-4.216; 14 -2.261,-4.216; 15 -1.753,-4.216; 16 -1.245,-4.216; 17 -0.762,-4.216; 18 -0.254,-4.216; 19 0.254,-4.216; 20 0.762,-4.216; 21 1.245,-4.216; 22 1.753,-4.216; 23 2.261,-4.216; 24 2.743,-4.216; 37 2.743,4.216; 38 2.261,4.216; 39 1.753,4.216; 40 1.245,4.216; 41 0.762,4.216; 42 0.254,4.216; 43 -0.254,4.216; 44 -0.762,4.216; 45 -1.245,4.216; 46 -1.753,4.216; 47 -2.261,4.216; 48 -2.743,4.216
SO8 = smd 0.6 x 2.2: 1 -1.905,-2.6; 2 -0.635,-2.6; 3 0.635,-2.6; 4 1.905,-2.6; 5 1.905,2.6; 6 0.635,2.6; 7 -0.635,2.6; 8 -1.905,2.6
OPI0 = drill 1 square: 1 0,0 | drill 1: 2 0,2.54; 3 2.54,0; 4 2.54,2.54; 5 5.08,0; 6 5.08,2.54; 7 7.62,0; 8 7.62,2.54; 9 10.16,0; 10 10.16,2.54; 11 12.7,0; 12 12.7,2.54; 13 15.24,0; 14 15.24,2.54; 15 17.78,0; 16 17.78,2.54; 17 20.32,0; 18 20.32,2.54; 19 22.86,0; 20 22.86,2.54; 21 25.4,0; 22 25.4,2.54; 23 27.94,0; 24 27.94,2.54; 25 30.48,0; 26 30.48,2.54 | hole 3: -5.815,1.694; 36.295,1.694; 36.295,41.805; -5.815,41.805
MKDSN1,5/2-5,08 = drill 1.3 pad 2: 1 -2.561,0.025; 2 2.519,0.025
W237-133 = drill 1.194 long: 1 -5.08,-0.635; 2 0,-0.635; 3 5.08,-0.635
MKDSN1,5/3-5,08 = drill 1.3 pad 2: 1 -7.641,0.025; 2 -2.561,0.025; 3 2.519,0.025
W237-4P = drill 1.194 long: 1 -7.62,-0.635; 2 -2.54,-0.635; 3 2.54,-0.635; 4 7.62,-0.635

### Placement (x,y rotation side)
1W-1  13.01,61.47 0 top
1W-2  25.07,61.47 0 top
C1  27.93,41.15 270 bottom
C2  30.78,41.15 90 top
C3  32.37,37.66 180 top
C4  166.68,83.06 0 top  (outside the outline)
C5  261.61,65.91 0 top  (outside the outline)
C6  15.23,43.37 0 bottom
C7  124.45,82.42 0 top  (outside the outline)
C8  18.72,22.1 270 top
C9  15.23,21.15 180 top
C10  22.85,17.65 0 top
C11  19.35,13.84 180 bottom
C12  28.88,15.75 90 top
C13  23.16,21.15 0 bottom
C14  15.86,37.6 180 top
C15  114.92,82.42 0 top  (outside the outline)
C16  64.44,20.51 270 bottom
C17  23.16,24.32 0 bottom
C18  58.41,15.43 90 bottom
C19  40.95,32.26 180 top
C20  154.61,83.06 0 top  (outside the outline)
C21  -23.51,60.83 0 top  (outside the outline)
C22  15.23,12.26 180 top
C23  35.23,18.29 0 top
C24  160.64,83.06 0 top  (outside the outline)
C25  -23.51,31.62 0 top  (outside the outline)
C26  36.18,107.19 0 top  (outside the outline)
C27  55.87,107.19 0 top  (outside the outline)
C28  247,34.8 0 top  (outside the outline)
C29  247,19.56 0 top  (outside the outline)
C30  75.55,107.19 0 top  (outside the outline)
C31  95.24,107.19 0 top  (outside the outline)
C32  247,74.17 0 top  (outside the outline)
C33  247,4.32 0 top  (outside the outline)
C34  261.61,59.56 0 top  (outside the outline)
D1  -19.06,41.78 0 top  (outside the outline)
D2  -19.06,12.57 0 top  (outside the outline)
D3  178.42,102.11 0 top  (outside the outline)
D4  178.42,79.88 0 top  (outside the outline)
D5  36.18,54.48 90 bottom
D10  32.37,54.48 90 bottom
D14  122.22,108.14 0 top  (outside the outline)
D15  144.45,96.39 0 top  (outside the outline)
D16  152.39,96.39 0 top  (outside the outline)
D19  52.06,82.74 0 top  (outside the outline)
D21  60.63,82.74 0 top  (outside the outline)
D22  69.2,82.74 0 top  (outside the outline)
D23  77.77,82.74 0 top  (outside the outline)
DD1  154.61,89.09 0 top  (outside the outline)
FB1  33.01,41.15 90 top
FB2  43.17,54.17 270 bottom
I2C  2.85,37.97 270 top
IC1  24.75,52.26 0 top
IC2  115.88,105.28 0 top  (outside the outline)
IC3  61.58,17.97 90 top
IC4  16.18,22.73 270 bottom
IC5  13.96,56.07 0 bottom
IC6  22.21,21.46 0 top
IC7  40.63,28.13 180 top
IC8  26.02,56.07 0 bottom
IC9  101.59,32.89 0 top
IC10  74LVC1G17DBV  [SOT23-5']  93.33,19.56 270 top
IC11  74LVC1G17DBV  [SOT23-5']  80,19.56 90 top
IC12  74LVC1G17DBV  [SOT23-5']  101.59,19.56 90 top
K1  156.83,22.1 270 top
K2  159.37,51.31 90 top
K3  117.46,51.31 90 top
K4  145.4,51.31 90 top
K5  131.43,51.31 90 top
K6  137.78,22.1 270 top
L1W1  128.89,82.11 0 top  (outside the outline)
L1W2  135.24,82.11 0 top  (outside the outline)
L4.7  16.5,16.7 180 top
LED1  36.18,52.58 180 top
LED2  32.37,52.58 180 top
LED3  9.2,88.46 0 top  (outside the outline)
LED4  15.23,88.46 0 top  (outside the outline)
LED5  21.26,88.46 0 top  (outside the outline)
LED6  27.29,88.46 0 top  (outside the outline)
LED7  -14.62,49.4 0 top  (outside the outline)
LED8  -14.62,20.19 0 top  (outside the outline)
LED9  -30.49,-10.92 0 top  (outside the outline)
LED10  -30.49,-22.35 0 top  (outside the outline)
OK1  69.84,15.43 0 top
OK2  86.35,15.43 0 top
OK9  112.38,16.07 0 top
Q1  43.8,48.13 90 bottom
Q2  20.31,45.59 270 top
Q3  -30.49,48.77 0 top  (outside the outline)
Q4  -30.49,19.56 0 top  (outside the outline)
Q7  115.24,89.09 0 top  (outside the outline)
Q8  121.91,89.09 0 top  (outside the outline)
Q9  104.76,48.13 90 top
Q10  135.24,89.09 0 top  (outside the outline)
Q11  91.43,48.13 90 top
Q13  19.67,95.44 0 top  (outside the outline)
Q14  30.15,95.44 0 top  (outside the outline)
Q16  40.63,95.44 0 top  (outside the outline)
Q17  51.1,95.44 0 top  (outside the outline)
R1  15.23,30.35 180 top
R2  15.23,32.26 180 top
R3  15.23,30.35 0 bottom
R4  15.23,32.26 0 bottom
R5  15.23,41.15 180 top
R6  15.23,34.16 180 bottom
R7  15.23,36.07 180 bottom
R8  29.83,41.15 90 bottom
R9  88.25,30.99 90 top
R10  16.18,24.32 90 top
R11  14.28,24.32 90 top
R12  28.88,41.15 270 top
R13  26.98,41.15 90 top
R14  25.7,21.46 270 top
R15  71.74,10.35 90 bottom
R16  66.66,10.35 90 bottom
R17  64.12,10.35 90 bottom
R18  88.25,10.35 90 bottom
R19  83.17,10.35 90 bottom
R20  110.48,10.99 90 bottom
R21  82.54,30.35 90 top
R22  34.28,47.5 270 top
R23  32.37,47.5 270 top
R24  102.22,23.37 90 top
R25  -31.76,-16.64 0 top  (outside the outline)
R26  -19.7,49.4 0 top  (outside the outline)
R27  114.29,76.71 0 top
R28  26.02,41.15 270 bottom
R29  23.16,41.15 270 top
R30  25.06,41.15 270 top
R31  119.05,76.71 0 top
R32  123.81,76.71 0 top
R33  15.23,41.15 0 bottom
R34  15.23,39.24 0 bottom
R35  21.25,41.15 270 top
R36  -31.76,42.42 0 top  (outside the outline)
R37  54.28,89.41 0 top  (outside the outline)
R38  138.1,76.71 0 top
R39  142.86,76.71 0 top
R40  -26.68,42.42 0 top  (outside the outline)
R41  -19.7,20.19 0 top  (outside the outline)
R42  -31.76,13.21 0 top  (outside the outline)
R43  -26.68,13.21 0 top  (outside the outline)
R44  180.33,109.09 0 top  (outside the outline)
R45  114.29,71.95 0 top
R46  252.72,34.8 0 top  (outside the outline)
R47  180.33,86.87 0 top  (outside the outline)
R48  252.08,20.19 0 top  (outside the outline)
R49  71.74,22.1 90 top
R50  69.2,22.1 90 top
R51  88.25,22.1 90 top
R52  85.71,22.1 90 top
R53  78.09,89.41 0 top  (outside the outline)
R54  82.86,89.41 0 top  (outside the outline)
R55  114.29,22.73 90 top
R56  251.45,74.8 0 top  (outside the outline)
R57  256.53,74.8 0 top  (outside the outline)
R58  246.37,69.09 0 top  (outside the outline)
R59  246.37,64.64 0 top  (outside the outline)
R60  246.37,59.56 0 top  (outside the outline)
R61  246.37,54.48 0 top  (outside the outline)
R62  246.37,49.4 0 top  (outside the outline)
R63  252.08,4.95 0 top  (outside the outline)
R64  -31.76,-28.07 0 top  (outside the outline)
R65  113.02,10.99 90 bottom
R66  111.75,22.73 90 top
R67  39.04,47.18 0 bottom
R68  39.04,49.09 0 bottom
R69  80.63,10.67 90 bottom
R70  15.23,43.05 0 top
R71  15.23,44.96 0 top
R72  15.23,27.81 180 top
R73  87.62,89.41 0 top  (outside the outline)
R74  82.22,96.08 0 top  (outside the outline)
R75  92.38,89.41 0 top  (outside the outline)
R76  119.05,71.95 0 top
R77  97.14,89.41 0 top  (outside the outline)
R82  87.3,96.08 0 top  (outside the outline)
R83  101.91,89.41 0 top  (outside the outline)
R84  8.24,83.06 0 top  (outside the outline)
R85  92.38,96.08 0 top  (outside the outline)
R86  13.01,83.06 0 top  (outside the outline)
R87  17.77,83.06 0 top  (outside the outline)
R88  97.46,96.08 0 top  (outside the outline)
R89  22.53,83.06 0 top  (outside the outline)
R90  27.29,83.06 0 top  (outside the outline)
SWD  38.72,12.57 0 top
TVS1  107.94,11.62 90 bottom
TVS3  74.28,10.99 90 bottom
TVS4  69.2,10.99 90 bottom
TVS5  90.79,10.99 90 bottom
TVS6  85.71,10.99 90 bottom
U2  26.66,32.26 270 top
U$10  59.04,43.05 0 top
U$11  75.55,43.05 0 top
UART  2.85,27.81 270 top
UART2  2.85,17.65 90 top
X0  8.56,40.51 270 top
X1  159.37,70.99 180 top
X2  117.14,70.99 180 top
X3  145.4,70.99 180 top
X4  59.04,60.83 0 top
X5  131.12,70.68 180 top
X6  154.29,4.95 180 top
X7  88.89,4.95 180 top
X8  135.24,4.95 180 top
X9  40.63,60.83 0 top
X10  105.4,58.93 180 top
X11  91.43,58.93 180 top
X13  107.94,4.95 180 top
X14  66.66,4.95 180 top
X15  75.55,60.83 0 top

### Tracks (layer width: path | path; a pad name or v marks a point on that pad's centre or on a via)
1W  (3 unrouted)
1W1-VDD  (2 unrouted)
1W2-VDD  (2 unrouted)
12V  (via drill 0.4)  (31 unrouted)
  Top 0.254: R12.1 28.88,45.59 29.51,46.23 29.51,52.26 v29.83,52.58
  Top 0.508: 23.17,20.19 23.16,20.19 23.23,20.19 IC6.3 23.16,18.74 C10.2 v26.02,17.65 28.55,17.65 28.88,17.99 C12.+ 28.88,22.42 v29.2,22.73 v31.1,22.73
  Bottom 0.254: D10.C 32.27,52.58 v29.83,52.58
  Bottom 0.508: FB2.2 36.24,52.74 D5.C | IC4.3 21.68,21.23 C13.2 21.76,13.96 C11.+ 24.12,13.84 26.02,15.75 v26.02,17.65 | D10.C 32.37,44.64 32.06,44.32 32.06,35.75 31.42,35.11 31.42,23.05 v31.1,22.73 v29.2,22.73
  Bottom 1.016: D5.C D10.C
+3V3  (via drill 0.4)  (2 unrouted)
  Top 0.254: U2.24 21.69,29.52 21.26,29.08 v21.26,27.18 | U2.36 29.4,27.29 29.83,26.86 v29.83,25.27 28.56,25.27 28.24,24.96 28.24,21.78 27.08,20.61 R14.2 | U2.48 32.89,35 v33.33,35.43 33.22,35.54 | LED1.A LED2.A 31.58,54.33 30.78,53.53 v30.78,45.28 33.01,45.28 34.28,44.01 34.28,40.51 33.96,40.2 FB1.1 33.01,39.88 33.22,39.66
  Top 0.508: 33.22,39.66 C3.1 33.22,35.54 | v29.83,25.27 32.37,25.27 v33.01,24.64 36.75,20.89 C23.+ 36.75,16 34.91,14.16 SWD.1
  Bottom 0.254: R8.2 29.83,42.73 30.78,43.69 v30.78,45.28
  Bottom 0.508: IC4.1 18.21,24.26 22.25,24.26 C17.2 22.31,26.12 22.21,26.23 | 22.21,26.23 26.66,26.23 27.61,25.27 v29.83,25.27 | 22.21,26.23 v21.26,27.18 | v33.33,35.43 32.37,34.48 32.37,25.27 v33.01,24.64
AD1  (3 unrouted)
AD2  (3 unrouted)
AD3  (3 unrouted)
AD-3V3  (via drill 0.3)
  Top 0.254: U2.13 21.9,35 v21.9,36.07
  Bottom 0.254: R34.1 16.05,39.24 | R33.1 R34.1 | R34.1 18.4,36.92 18.4,35.11 19.04,34.48 20.94,34.48 21.9,35.43 v21.9,36.07
AD-5V0
  Top 0.254: U2.12 23.91,38.81 23.48,39.24 21.58,39.24 21.25,39.57 R35.2 20.2,40.3 19.04,41.47 17.45,41.47 17.13,41.15 R5.1
AD-12V
  Top 0.254: R12.2 R13.1 26.97,39.56 26.66,39.24 25.7,39.24 24.9,38.44 U2.10
AD-BTT
  Top 0.254: 25.14,40.22 R30.2 | R29.2 R30.2 | U2.11 24.4,38.89 25.07,39.56 R30.2
ADR2  (1 unrouted)
ADR3  (1 unrouted)
ADR4  (1 unrouted)
BAT+  (via drill 0.4)  (1 unrouted)
  Top 0.254: R30.1 25.07,42.01 25.07,44.01 26.97,45.91 28.24,45.91 28.88,46.54 28.88,52.9 29.2,53.21 v29.2,54.16
  Bottom 0.254: D10.A 30.04,56.28 29.2,55.43 v29.2,54.16
EN_1W-1  (2 unrouted)
EN_1W-2  (2 unrouted)
FET  (6 unrouted)
FET1  (6 unrouted)
GND  (via drill 0.4)  (150 unrouted)
  Top 0.254: R29.1 | U2.8 25.9,35.24 | U2.47 29.55,34.52 | U2.35 28.92,26.9 | 23.68,30 U2.23 20.94,30
  Top 0.508: IC6.1 21.26,17.84 C10.1
  Bottom 0.254: R68.1 v41.26,49.09 v41.27,49.08 Q1.2
  Bottom 0.508: I2C.3 3.8,34.48 v5.07,34.48 | 5.07,26.38 4.91,26.54 4.12,26.54 UART.3 UART2.3
  other vias: 6.34,44.32 12.85,40.67 26.02,13.21 31.74,13.21 6.34,13.84 16.5,18.92 16.5,16.38 18.09,11.3 26.02,19.24 20.15,22.26 6.34,27.81 12.69,23.37 30.78,36.07 29.83,44.01 26.98,44.01 28.56,30.67 22.85,27.18 5.07,31.31 5.07,37.02 5.07,39.56 5.07,26.54 33.01,44.01 36.82,27.81 33.01,20.51 19.67,27.18 35.23,33.53 33.01,22.73 24.12,23.05 28.56,26.54 29.52,24 33.64,27.81 27.13,23.69 20.15,20.19 22.85,16.07 23.8,44.01 13.01,29.08 22.53,37.97 24.75,30.35 14.59,48.13 19.04,42.74
  cutout Bottom: 4.75,0.83 4.75,49.09 55.55,49.09 55.55,0.83
  cutout Top: 4.75,0.83 4.75,49.09 55.55,49.09 55.55,0.83
GPIO1  (2 unrouted)
GPIO2  (2 unrouted)
GPIO4  (2 unrouted)
GPIO5  (2 unrouted)
GPIO6  (2 unrouted)
GPIO7  (2 unrouted)
GREEN
  Top 0.254: R23.2 32.59,46.65 34.91,44.32 34.91,40.2 34.28,39.56 34.28,35.11 33.17,34.01 U2.46
IN12V  (1 unrouted)
INTR  (1 unrouted)
  Top 0.254: 24.4,26.19 23.8,25.59 18.72,25.59 17.45,26.86 17.45,28.45 16.81,29.08 14.91,29.08 14.38,28.55 R72.2 X0.12
IO13  (2 unrouted)
N$1  (4 unrouted)
  Bottom 0.508: C16.1 61.71,21.91 IC3.4
N$2  (2 unrouted)
N$3
  Top 0.508: IC6.2 22.21,20.7 21.7,21.21 18.72,21.21 C8.2
  Top 1.016: L4.7.P$1 18.72,16.95 C8.2
N$4  (via drill 0.3)
  Top 0.254: Q2.3 v24.75,45.59
  Bottom 0.254: v24.75,45.59 26.02,44.32 R28.1
N$5
  Top 0.254: R71.2 16.08,45.81 16.81,46.54 Q2.1
N$6  (via drill 0.4)
  other vias: 30.15,22.73
N$7  (1 unrouted)
N$8  (1 unrouted)
N$9  (3 unrouted)
N$10  (1 unrouted)
N$11  (1 unrouted)
N$13  (1 unrouted)
N$14  (1 unrouted)
N$15  (3 unrouted)
N$16  (2 unrouted)
N$17
  Top 0.254: IC6.6 | 18.72,23.37 C8.1
  Top 0.508: IC6.6 21.26,23.37 18.72,23.37
N$18  (1 unrouted)
N$19  (1 unrouted)
N$20  (3 unrouted)
N$21  (2 unrouted)
N$22
  Top 0.254: 23.17,22.73 IC6.4 23.17,23.37 22.21,24.32 17.77,24.32 16.92,25.17 R10.2 R11.2
N$23  (1 unrouted)
N$24  (1 unrouted)
N$25  (2 unrouted)
N$26  (2 unrouted)
N$27  (2 unrouted)
N$28  (2 unrouted)
N$29  (11 unrouted)
  Bottom 0.508: C16.2 64.31,19.24 IC3.3
N$30  (1 unrouted)
N$32  (2 unrouted)
  Bottom 0.254: R18.1 88.29,9.54
N$33  (2 unrouted)
  Bottom 0.254: R19.1 83.21,9.54
N$35  (1 unrouted)
N$36  (3 unrouted)
N$37  (1 unrouted)
N$39  (2 unrouted)
N$40  (2 unrouted)
N$41  (2 unrouted)
N$42  (2 unrouted)
N$43  (2 unrouted)
N$44  (2 unrouted)
N$45  (1 unrouted)
N$46  (2 unrouted)
N$47  (1 unrouted)
N$48  (1 unrouted)
N$49  (1 unrouted)
N$50  (1 unrouted)
N$51  (1 unrouted)
N$52  (1 unrouted)
N$53  (1 unrouted)
N$54  (1 unrouted)
N$55  (3 unrouted)
N$56  (1 unrouted)
N$58  (2 unrouted)
N$59  (2 unrouted)
N$60  (2 unrouted)
N$61  (2 unrouted)
N$62  (1 unrouted)
N$63  (2 unrouted)
N$65  (1 unrouted)
N$66  (1 unrouted)
N$69  (1 unrouted)
N$70  (1 unrouted)
N$71  (1 unrouted)
N$74  (1 unrouted)
N$75
  Top 0.254: R22.1 34.28,50.04 35.07,50.83 LED1.C
N$95
  Bottom 0.254: Q1.1 R67.1
N$98  (1 unrouted)
  Bottom 0.508: C18.1 61.45,14.03 IC3.1
N$99  (1 unrouted)
  Bottom 0.508: C18.2 61.45,16.83 IC3.2
N$111  (3 unrouted)
N$112  (1 unrouted)
N$115  (1 unrouted)
N$116  (1 unrouted)
N$117  (2 unrouted)
N$118  (1 unrouted)
N$119
  Top 0.254: LED2.C R23.1
N$120  (3 unrouted)
N$121  (2 unrouted)
N$122  (1 unrouted)
N$123  (1 unrouted)
N$124  (3 unrouted)
N$125  (2 unrouted)
N$126  (1 unrouted)
N$127  (1 unrouted)
N$128  (2 unrouted)
N$129  (2 unrouted)
OPT-EN  (via drill 0.4)
  Top 0.254: U2.41 33.13,31.5 33.64,30.99 35.55,30.99 36.18,31.62 36.18,38.29 37.13,39.24 37.13,46.54 v36.5,47.18
  Bottom 0.254: R68.2 R67.2 v36.5,47.18
OPT-IN1  (2 unrouted)
OPT-IN2  (2 unrouted)
OPT-V+  (2 unrouted)
PA06
  Top 0.254: R71.1 R70.1 11.1,43.05 9.83,41.78 9.83,39.88 9.2,39.24 7.92,39.24 7.29,38.61 7.29,33.53 7.92,32.89 X0.7
PWR-EN
  Top 0.254: IC6.5 22.28,22.61 22.28,22.04 22.53,21.78 24.24,21.78 24.78,22.31 R14.1 25.7,23.37 26.5,24.16 26.5,25.11 25.41,26.2 U2.28
RED
  Top 0.254: R22.2 34.28,45.91 35.55,44.64 35.55,39.88 34.91,39.24 34.91,34.8 33.62,33.5 U2.45
RESET  (via drill 0.4)
  Top 0.254: U2.7 26.4,37.72 26.66,37.97 27.93,37.97 v28.24,38.29
  Bottom 0.254: R8.1 C1.2 | v28.24,38.29 28.24,38.93 27.93,39.24 C1.2 | C1.2 R28.2
RX  (via drill 0.3)
  Top 0.254: U2.31 26.91,31.69 v25.7,32.89 | R2.1 17.13,32.26 v17.45,32.58
  Bottom 0.254: v25.7,32.89 25.39,32.58 v17.45,32.58
SCL  (via drill 0.3, 0.4)  (3 unrouted)
  Top 0.254: v35.23,31.94 34.91,31.62 33.96,31.62 33.58,32 U2.42 28.5,32 v26.97,33.53 | v12.62,33.84 v17.45,33.84 | IC7.5 41.58,25.75 v41.26,25.43
  Bottom 0.254: I2C.2 5.39,35.43 X0.5 9.2,35.43 10.46,34.16 12.31,34.16 v12.62,33.84 12.94,34.16 R6.1 | v26.97,33.53 26.66,33.84 25.39,33.84 24.75,33.21 18.08,33.21 v17.45,33.84 | v35.23,31.94 34.91,31.62 34.91,30.35 35.86,29.4 40.31,29.4 40.63,29.08
SDA  (via drill 0.3, 0.4)  (2 unrouted)
  Top 0.254: v34.28,32.58 34.21,32.51 U2.43 28.94,32.51 27.93,33.53 v27.93,34.16 | IC7.4 39.68,25.75 v39.36,25.43 | v13.2,34.99 13.32,35.11 v17.45,35.11
  Bottom 0.254: X0.3 9.83,36.7 11.54,36.7 12.18,36.07 13.07,36.07 | 8.5,37.97 X0.3 | R7.1 13.07,36.07 | v13.2,34.99 13.2,35.94 13.07,36.07 | I2C.1 5.39,37.97 X0.3 | v27.93,34.16 27.61,34.48 25.07,34.48 24.44,33.84 18.72,33.84 v17.45,35.11 | v34.28,32.58 34.28,28.77 37.61,25.43 v39.36,25.43
SWCKL
  Top 0.254: U2.37 31.31,29.52 31.42,29.4 31.42,26.86 31.74,26.54 33.33,26.54 39.99,19.88 SWD.3
SWDIO
  Top 0.254: U2.34 28.41,29.25 28.56,29.4 29.51,29.4 30.78,28.13 30.78,26.54 31.42,25.91 33.01,25.91 38.72,20.19 38.72,14.48 37.45,13.21 SWD.2
TX  (via drill 0.3)
  Top 0.254: U2.30 26.4,31.24 26.02,31.62 v25.7,31.62 | R1.1 v17.45,30.35
  Bottom 0.254: v17.45,30.35 17.45,30.99 18.4,31.94 25.39,31.94 v25.7,31.62
VCC  (2 unrouted)
VDD  (16 unrouted)
VDDA
  Top 0.254: FB1.2 33.01,41.78 32.06,41.78 31.74,41.47 31.74,40.51 31.52,40.3 C2.1 30.78,39.24 29.51,39.24 | U2.1 29.4,39.13 29.51,39.24 | U2.9 25.41,38 26.02,38.61 26.97,38.61 27.61,39.24 29.51,39.24
X7.2  (3 unrouted)
Z2RX
  Bottom 0.254: X0.11 5.39,24.64 5.39,18.61 4.43,17.65 UART2.2
Z2TX
  Bottom 0.254: X0.13 6.97,25.27 6.02,24.32 6.02,18.29 UART2.1
Z3V3  (via drill 0.4)  (8 unrouted)
  Top 0.254: R72.1 16.18,27.71 v16.18,26.54
  Top 0.508: v16.18,26.54 16.81,26.54 18.4,24.96 25.39,24.96 v25.7,24.64
  Bottom 0.508: 16.05,29.08 16.05,31.62 R4.1 16.05,31.75 16.05,34.16 R6.2 16.05,34.29 16.05,36.7 R7.2 16.05,36.83 14.4,38.48 14.4,39.24 R34.2 | 16.05,29.08 R3.1 | X0.17 8.56,20.83 9.83,22.1 9.83,23.37 10.46,24 11.99,24 14.53,26.54 16.05,26.54 | 9.2,40.51 X0.1 | 9.2,40.51 10.46,39.24 R34.2 | 16.05,29.08 16.05,26.54 | 14.28,39.34 R34.2 | v16.18,26.54 16.05,26.54 | 27.93,21.46 25.7,23.69 v25.7,24.64 | C6.2 12.05,43.37 9.2,40.51
Z5V
  Top 0.508: X0.2 X0.4 | 14.28,37.97 14.28,41.15 R5.2 | 14.28,37.97 C14.+ 14.15,37.85 | X0.4 9.83,36.7 9.83,22.1 10.46,21.46 12.56,21.46 12.87,21.15 C9.2 R11.1 | 14.28,37.97 X0.4
  Top 1.016: C9.2 14.28,16.7 | C22.2 14.28,16.7 | 14.28,16.7 L4.7.P$2
ZRX
  Top 0.254: 14.4,30.35 R3.2 X0.10
  Bottom 0.254: UART.2 4.12,29.08 9.83,29.08 X0.10 R3.2
ZTX
  Top 0.254: R4.2 11.73,32.26 X0.8
  Bottom 0.254: R4.2 11.73,32.26 X0.8 10.46,32.89 9.2,34.16 6.66,34.16 UART.1

### Text on the board
Top: TOP
Bottom: BOTTOM
tNames: + | SDA | SCL | GND | RX | TX | GR | GR | RX | TX | + D C G
bNames: - PS A | VCC | SWDIO | SWCLK | GND